# EAGLE design main_board2 (EAGLE 6.1)
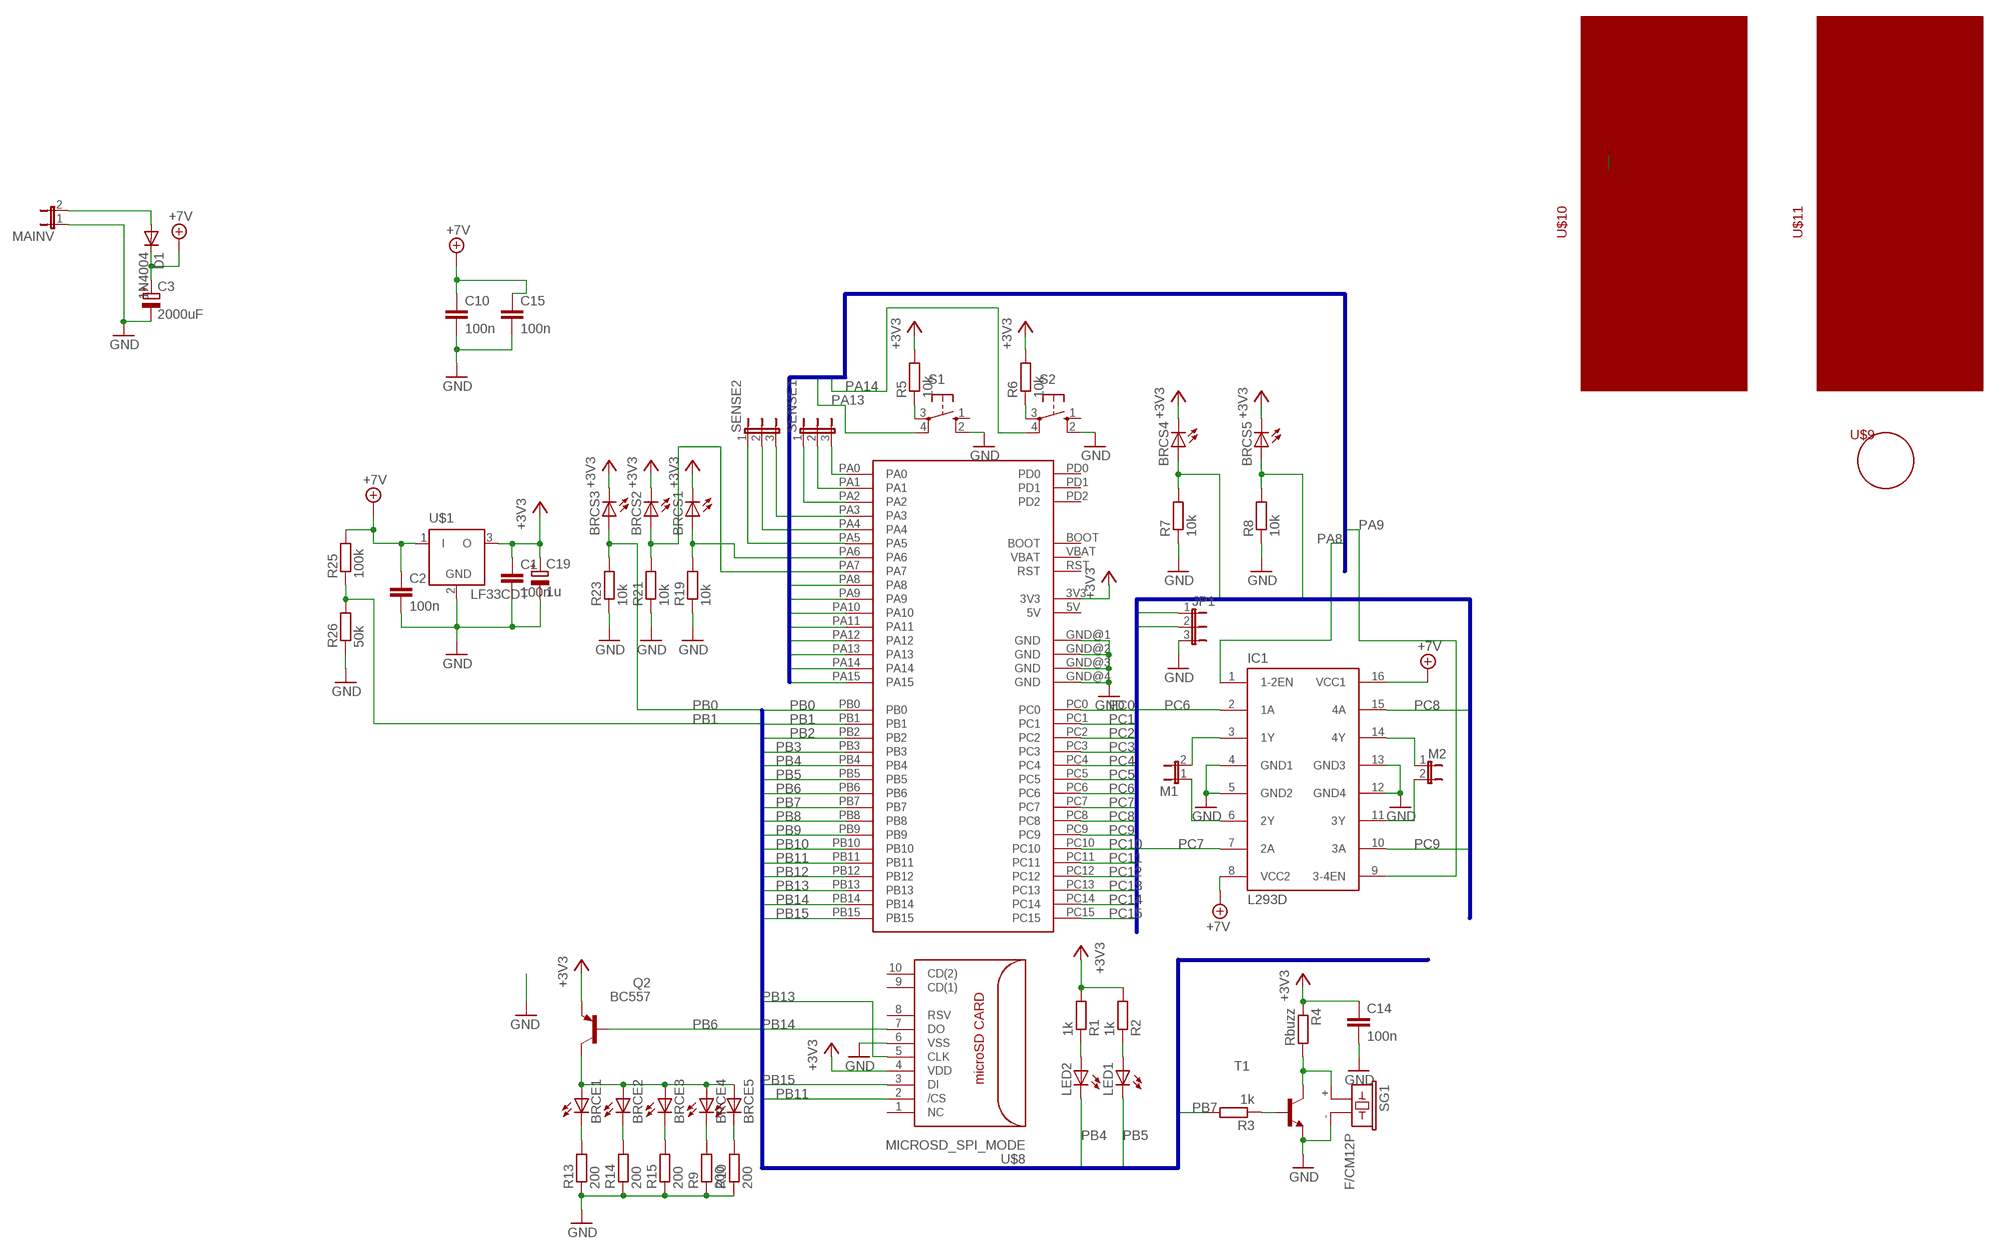
[diagram p0: schematic, sheet 1]

## Parts
BRCE1  LED5MM  [LED5MM]
BRCE2  LED5MM  [LED5MM]
BRCE3  LED5MM  [LED5MM]
BRCE4  LED5MM  [LED5MM]
BRCE5  LED5MM  [LED5MM]
BRCS1  LED5MM  [LED5MM]
BRCS2  LED5MM  [LED5MM]
BRCS3  LED5MM  [LED5MM]
BRCS4  LED5MM  [LED5MM]
BRCS5  LED5MM  [LED5MM]
C1  100n  C-EUC1206  [C1206]
C2  100n  C-EUC1206  [C1206]
C3  2000uF  CPOL-EUE3.5-10  [E3,5-10]
C10  100n  C-EUC1206  [C1206]
C14  100n  C-EUC1206  [C1206]
C15  100n  C-EUC1206  [C1206]
C19  1u  CPOL-EUB  [PANASONIC_B]
D1  1N4004  [DO41-10]
IC1  L293D  [DIL16]
JP1  JP2E  [JP2]
LED1  LED3MM  [LED3MM]
LED2  LED3MM  [LED3MM]
M1  JP1E  [JP1]
M2  JP1E  [JP1]
MAINV  JP1E  [JP1]
Q2  BC557  [TO92]
R1  1k  R-EU_M1206  [M1206]
R2  1k  R-EU_M1206  [M1206]
R3  1k  R-EU_M1206  [M1206]
R4  Rbuzz  R-EU_M1206  [M1206]
R5  10k  R-EU_M1206  [M1206]
R6  10k  R-EU_M1206  [M1206]
R7  10k  R-EU_M1206  [M1206]
R8  10k  R-EU_M1206  [M1206]
R9  200  R-EU_M1206  [M1206]
R10  200  R-EU_M1206  [M1206]
R13  200  R-EU_M1206  [M1206]
R14  200  R-EU_M1206  [M1206]
R15  200  R-EU_M1206  [M1206]
R19  10k  R-EU_M1206  [M1206]
R21  10k  R-EU_M1206  [M1206]
R23  10k  R-EU_M1206  [M1206]
R25  100k  R-EU_M1206  [M1206]
R26  50k  R-EU_M1206  [M1206]
S1  10-XX  [B3F-10XX]
S2  10-XX  [B3F-10XX]
SENSE1  JP2E  [JP2]
SENSE2  JP2E  [JP2]
SG1  F/CM12P  [F/CM12P]
T1  BC547B-NPN-TO92-CBE  [TO92-CBE]
U$1  LF33CDT  [DPAK]
U$2  STM32_DISCOVERY  [STM32_DISCOVERY]
U$8  MICROSD_SPI_MODE  [MICRO_SD_CONNECTOR]
U$9  POLOLU952  [BALLB]
U$10  POLOLU0993B  [MOTORB]
U$11  POLOLU0993B  [MOTORB]

## Nets
+3V3: BRCS1.K(C) BRCS2.K(C) BRCS3.K(C) BRCS4.K(C) BRCS5.K(C) C1.1 C14.1 C19.+ Q2.1(E) R1.2 R2.2 R4.1 R5.2 R6.2 U$1.3(O) U$2.3V3 U$8.4(VDD)
+7V: C2.1 C3.+ C10.1 C15.1 D1.C IC1.8(VCC2) IC1.16(VCC1) R25.2 U$1.1(I)
GND: C1.2 C2.2 C3.- C10.2 C14.2 C15.2 C19.- IC1.4(GND1) IC1.5(GND2) IC1.12(GND4) IC1.13(GND3) JP1.3 MAINV.1 R7.1 R8.1 R9.1 R10.1 R13.1 R14.1 R15.1 R19.1 R21.1 R23.1 R26.1 S1.2(S1) S2.2(S1) SG1.- T1.E U$1.2(GND) U$2.GND@1(GND) U$2.GND@2(GND) U$2.GND@3(GND) U$2.GND@4(GND) U$8.6(VSS)
N$1: SENSE1.3 U$2.PA0
N$2: SENSE1.2 U$2.PA1
N$3: SENSE1.1 U$2.PA2
N$4: SENSE2.3 U$2.PA3
N$5: SENSE2.2 U$2.PA4
N$6: SENSE2.1 U$2.PA5
N$7: LED2.A R1.1
N$8: LED1.A R2.1
N$9: R3.1 T1.B
N$10: R4.2 SG1.+ T1.C
N$11: R6.1 S2.3(P)
N$12: R5.1 S1.3(P)
N$13: BRCE4.K(C) R9.2
N$14: BRCE5.K(C) R10.2
N$28: BRCE1.K(C) R13.2
N$29: BRCE2.K(C) R14.2
N$30: BRCE3.K(C) R15.2
N$31: BRCE1.A BRCE2.A BRCE3.A BRCE4.A BRCE5.A Q2.3(C)
N$43: D1.A MAINV.2
N$44: BRCS1.A R19.2 U$2.PA6
N$46: BRCS2.A R21.2 U$2.PA7
N$53: IC1.3(1Y) M1.2
N$54: IC1.6(2Y) M1.1
N$55: IC1.14(4Y) M2.1
N$56: IC1.11(3Y) M2.2
PA8: IC1.1(1-2EN) U$2.PA8
PA9: IC1.9(3-4EN) U$2.PA9
PA10: U$2.PA10
PA11: U$2.PA11
PA12: U$2.PA12
PA13: S1.4(P1) U$2.PA13
PA14: S2.4(P1) U$2.PA14
PA15: U$2.PA15
PB0: BRCS3.A R23.2 U$2.PB0
PB1: R25.1 R26.2 U$2.PB1
PB2: U$2.PB2
PB3: U$2.PB3
PB4: LED2.K(C) U$2.PB4
PB5: LED1.K(C) U$2.PB5
PB6: Q2.2(B) U$2.PB6
PB7: R3.2 U$2.PB7
PB8: U$2.PB8
PB9: U$2.PB9
PB10: U$2.PB10
PB11: U$2.PB11 U$8.2(/CS)
PB12: U$2.PB12
PB13: U$2.PB13 U$8.5(CLK)
PB14: U$2.PB14 U$8.7(DO)
PB15: U$2.PB15 U$8.3(DI)
PC0: U$2.PC0
PC1: U$2.PC1
PC2: U$2.PC2
PC3: U$2.PC3
PC4: BRCS4.A R7.2 U$2.PC4
PC5: BRCS5.A R8.2 U$2.PC5
PC6: IC1.2(1A) U$2.PC6
PC7: IC1.7(2A) U$2.PC7
PC8: IC1.15(4A) U$2.PC8
PC9: IC1.10(3A) U$2.PC9
PC10: JP1.1 U$2.PC10
PC11: JP1.2 U$2.PC11
PC12: U$2.PC12
PC13: U$2.PC13
PC14: U$2.PC14
PC15: U$2.PC15
Unconnected: S1.1(S) S2.1(S) U$2.5V U$2.BOOT U$2.NC@1(NC) U$2.NC@2(NC) U$2.PD0 U$2.PD1 U$2.PD2 U$2.RST U$2.VBAT U$8.1(NC) U$8.8(RSV) U$8.9(CD(1)) U$8.10(CD(2))

## Buses
PC[0..15]
PB[0..15]
PA[8..15]

## Library data of the parts
BRCE1-BRCE5 BRCS1-BRCS5 LED1 LED2 = led:LED: LED OSRAM: - CHIPLED LG R971, LG N971, LY N971, LG Q971, LY Q971, LO R971, LY R971 LH N974, LH R974 LS Q976, LO Q976, LY Q976 LO Q996 - Hyper CHIPLED LW Q18S LB Q993, LB Q99A, LB R99A - SideLED LS A670, LO A670, LY A670, LG A670, LP A670 LB A673, LV A673, LT A673, LW A673 LH A674 LY A675 LS A676, LA A676, LO A676, LY A676, LW A676 LS A679, LY A679, LG A679 - Hyper Micro SIDELED® LS Y876, LA Y876, LO Y876, LY Y876 LT Y87S - SmartLED LW L88C, LW L88S LB L89C, LB L89S, LG L890 LS L89K, LO L89K, LY L89K LS L896, LA L896, LO L896, LY L896 - TOPLED LS T670, LO T670, LY T670, LG T670, LP T670 LSG T670, LSP T670, LSY T670, LOP T670, LYG T670 LG T671, LOG T671, LSG T671 LB T673, LV T673, LT T673, LW T673 LH T674 LS T676, LA T676, LO T676, LY T676, LB T676, LH T676, LSB T676, LW T676 LB T67C, LV T67C, LT T67C, LS T67K, LO T67K, LY T67K, LW E67C LS E67B, LA E67B, LO E67B, LY E67B, LB E67C, LV E67C, LT E67C LW T67C LS T679, LY T679, LG T679 LS T770, LO T770, LY T770, LG T770, LP T770 LB T773, LV T773, LT T773, LW T773 LH T774 LS E675, LA E675, LY E675, LS T675 LS T776, LA T776, LO T776, LY T776, LB T776 LHGB T686 LT T68C, LB T68C - Hyper Mini TOPLED® LB M676 - Mini TOPLED Santana® LG M470 LS M47K, LO M47K, LY M47K Source: http://www.osram.convergy.de LUXEON: - LUMILED® LXK2-PW12-R00, LXK2-PW12-S00, LXK2-PW14-U00, LXK2-PW14-V00 LXK2-PM12-R00, LXK2-PM12-S00, LXK2-PM14-U00 LXK2-PE12-Q00, LXK2-PE12-R00, LXK2-PE12-S00, LXK2-PE14-T00, LXK2-PE14-U00 LXK2-PB12-K00, LXK2-PB12-L00, LXK2-PB12-M00, LXK2-PB14-N00, LXK2-PB14-P00, LXK2-PB14-Q00 LXK2-PR12-L00, LXK2-PR12-M00, LXK2-PR14-Q00, LXK2-PR14-R00 LXK2-PD12-Q00, LXK2-PD12-R00, LXK2-PD12-S00 LXK2-PH12-R00, LXK2-PH12-S00 LXK2-PL12-P00, LXK2-PL12-Q00, LXK2-PL12-R00 Source: www.luxeon.com KINGBRIGHT: KA-3528ASYC Source: www.kingbright.com
C1 C2 C10 C14 C15 = rcl:C-EU: CAPACITOR, European symbol
C3 C19 = rcl:CPOL-EU: POLARIZED CAPACITOR, European symbol
D1 = diode:1N4004: DIODE general purpose rectifier, 1 A
IC1 = st-microelectronics:L293D: PUSH-PULL 4 CHANNEL DRIVER; MPN: L293D; OC_FARNELL: 9589619; OC_NEWARK: 56P8249
JP1 SENSE1 SENSE2 = jumper:JP2E: JUMPER
M1 M2 MAINV = jumper:JP1E: JUMPER
Q2 = transistor-pnp:BC557: PNP Transistor
R1-R10 R13-R15 R19 R21 R23 R25 R26 = resistor:R-EU_: RESISTOR, European symbol
S1 S2 = switch-omron:10-XX: OMRON SWITCH; MPN: B3F-1000; OC_FARNELL: 176432; OC_NEWARK: 36M3542
SG1 = buzzer:F/CM12P: BUZZER Source: Buerklin; OC_FARNELL: unknown; OC_NEWARK: unknown
T1 = transistor:*-NPN-: NPN Transistror BF959 corrected 2008.03.06
U$1 = robot:LF33CDT
U$2 = stm32_discovery:STM32_DISCOVERY: STM32 Value line discovery
U$8 = con-molex-microsd:MICROSD_SPI_MODE: MOLEX - 49225-0821 - CONNECTEUR MICRO SD PUSH/PUSH REV Fabricant: MOLEX Code commande Farnell: 1366700 <http://fr.farnell.com/molex/49225-0821/connecteur-micro-sd-push-push-rev/dp/1366700?Ntt=1366700> Référence fabricant: 49225-0821
U$9 = robot:POLOLU952
U$10 U$11 = robot:POLOLU0993B

## Board
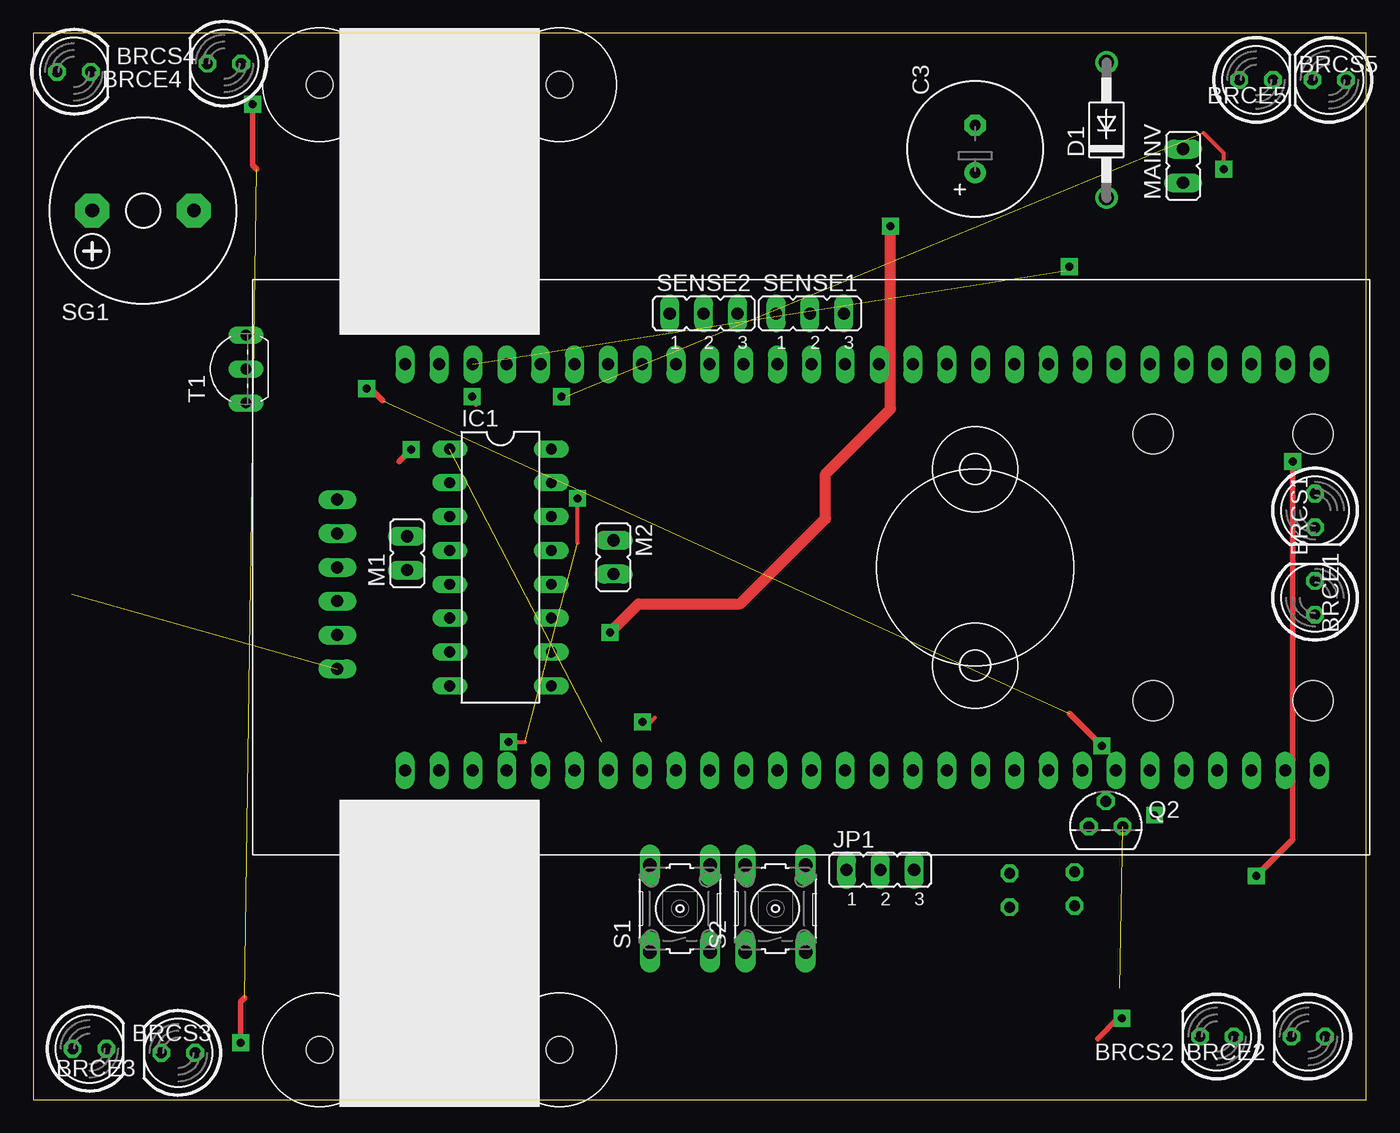
[diagram p1: board, top side]
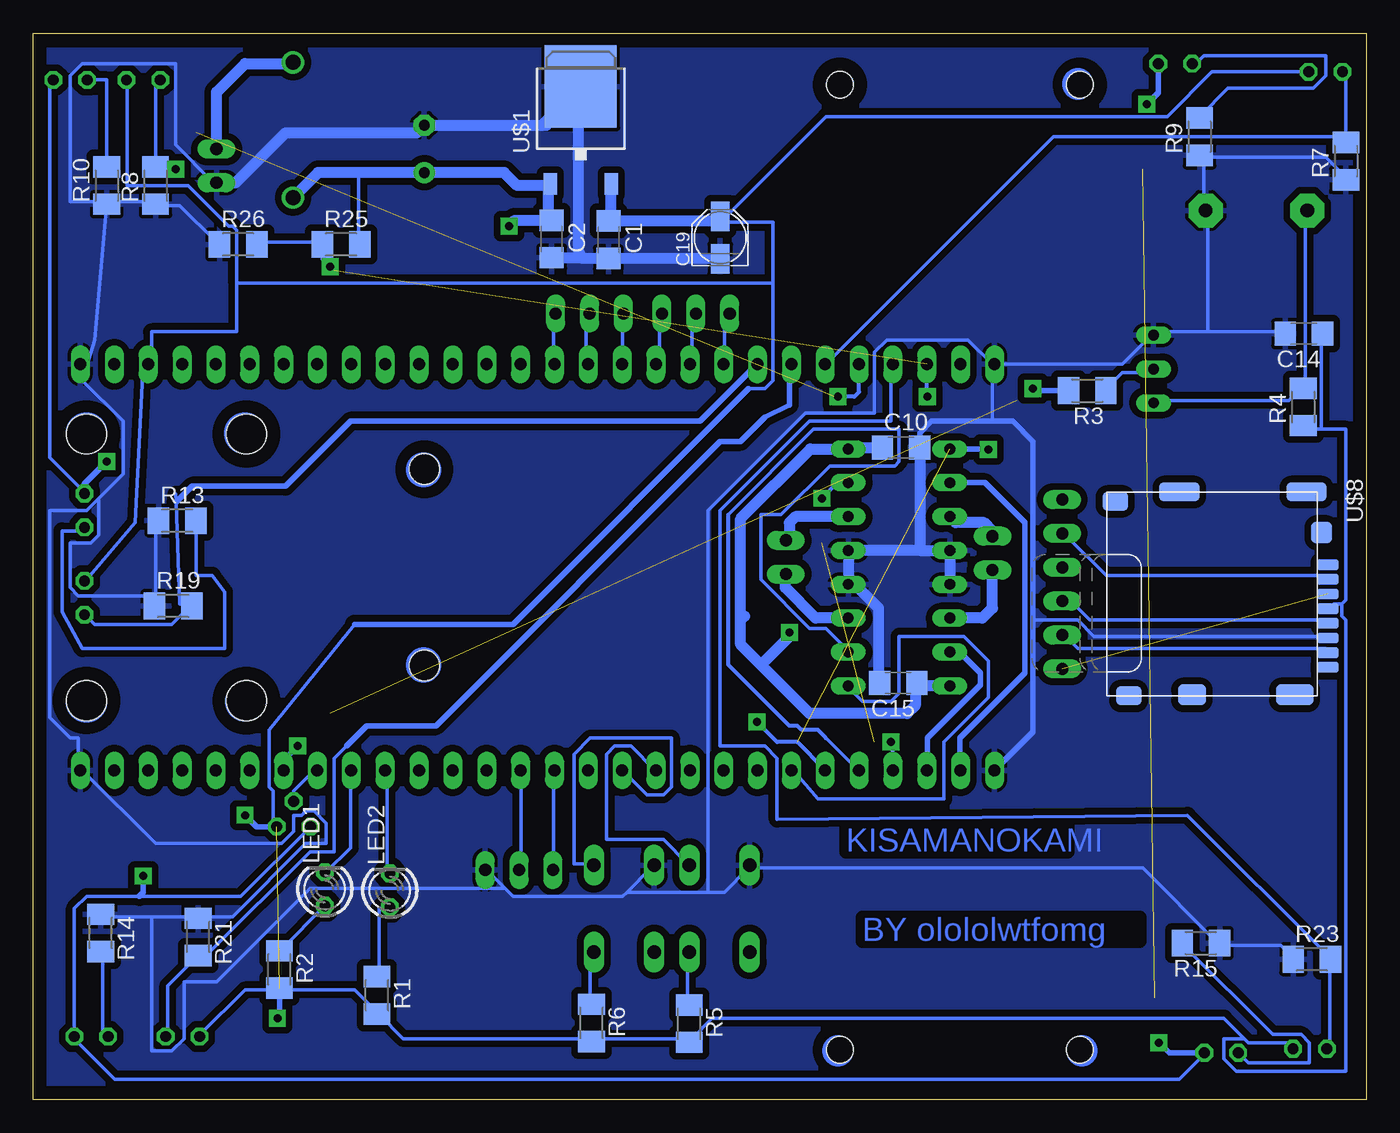
[diagram p2: board, bottom side, seen from below]

Size 100 x 80 mm. Coordinates in mm from the lower left corner, seen from the top.
Outline: 0,0 100,0 100,80 0,80 0,0
Copper layers (1*16): Top 0.035mm / dielectric 1.5mm / Bottom 0.035mm
Design rules "default": minimum track width 10mil, minimum drill 24mil, track to track 8mil, track to pad 8mil, pad to pad 8mil, via to via 8mil, smd to smd 8mil, copper to edge 40mil, drill to drill 8mil, minimum pad ring 10mil, minimum via ring 8mil, stop-mask expansion 4mil, vias tented up to drill 0mil, thermal gap 10mil
Holes 3 mm at 96.01,49.93 96.01,29.93 84.01,49.93 84.01,29.92

### Footprints (pad centres in the part's own frame; a part is rotated, then mirrored left to right if it is on the bottom)
LED5MM = drill 0.813 octagon: A -1.27,0; K 1.27,0
C1206 = smd 1.6 x 1.8: 1 -1.4,0; 2 1.4,0
E3,5-10 = drill 0.813 pad 1.6 round: + -1.778,0 | drill 0.813 pad 1.6 octagon: - 1.778,0
PANASONIC_B = smd 2.2 x 1.4: + 1.6,0; - -1.6,0
DO41-10 = drill 1.118 round: A 5.08,0; C -5.08,0
DIL16 = drill 0.813 long: 1 -8.89,-3.81; 2 -6.35,-3.81; 3 -3.81,-3.81; 4 -1.27,-3.81; 5 1.27,-3.81; 6 3.81,-3.81; 7 6.35,-3.81; 8 8.89,-3.81; 9 8.89,3.81; 10 6.35,3.81; 11 3.81,3.81; 12 1.27,3.81; 13 -1.27,3.81; 14 -3.81,3.81; 15 -6.35,3.81; 16 -8.89,3.81
JP2 = drill 0.914 long: 1 -2.54,0; 2 0,0; 3 2.54,0
LED3MM = drill 0.813 octagon: A -1.27,0; K 1.27,0
JP1 = drill 0.914 long: 1 0,-1.27; 2 0,1.27
TO92 = drill 0.813 octagon: 1 1.27,0; 2 0,1.905; 3 -1.27,0
M1206 = smd 1.6 x 2: 1 -1.4,0; 2 1.4,0
B3F-10XX = drill 1.016 long: 1 -3.251,2.261; 2 3.251,2.261; 3 -3.251,-2.261; 4 3.251,-2.261
F/CM12P = drill 1.016 pad 2.54 octagon: + 3.81,0; - -3.81,0
TO92-CBE = drill 0.813 long: B 0,0; C -2.54,0; E 2.54,0
DPAK = smd 1 x 1.6: 1 -2.28,-6.07; 3 2.28,-6.07 | smd 5.4 x 6.2: 2 0,1.23
STM32_DISCOVERY = drill 0.9 long: 3V3 -15.24,29.21; 5V 15.24,29.21; BOOT 15.24,21.59; GND@1 -15.24,34.29; GND@2 15.24,34.29; GND@3 -15.24,-34.29; GND@4 15.24,-34.29; NC@1 -15.24,31.75; NC@2 15.24,31.75; PA0 -15.24,-1.27; PA1 -15.24,-3.81; PA2 -15.24,-6.35; PA3 -15.24,-8.89; PA4 -15.24,-11.43; PA5 -15.24,-13.97; PA6 -15.24,-16.51; PA7 -15.24,-19.05; PA8 15.24,-21.59; PA9 15.24,-19.05; PA10 15.24,-16.51; PA11 15.24,-13.97; PA12 15.24,-11.43; PA13 15.24,-8.89; PA14 15.24,-6.35; PA15 15.24,-3.81; PB0 -15.24,-26.67; PB1 -15.24,-29.21; PB2 -15.24,-31.75; PB3 15.24,8.89; PB4 15.24,11.43; PB5 15.24,13.97; PB6 15.24,16.51; PB7 15.24,19.05; PB8 15.24,24.13; PB9 15.24,26.67; PB10 -5.08,-39.37; PB11 -2.54,-39.37; PB12 0,-39.37; PB13 2.54,-39.37; PB14 5.08,-39.37; PB15 7.62,-39.37; PC0 -15.24,8.89; PC1 -15.24,6.35; PC2 -15.24,3.81; PC3 -15.24,1.27; PC4 -15.24,-21.59; PC5 -15.24,-24.13; PC6 15.24,-31.75; PC7 15.24,-29.21; PC8 15.24,-26.67; PC9 15.24,-24.13; PC10 15.24,-1.27; PC11 15.24,1.27; PC12 15.24,3.81; PC13 -15.24,24.13; PC14 -15.24,21.59; PC15 -15.24,19.05; PD0 -15.24,16.51; PD1 -15.24,13.97; PD2 15.24,6.35; RST -15.24,11.43; VBAT -15.24,26.67
MICRO_SD_CONNECTOR = smd 0.8 x 1.6: 1 -2.03,8.2; 2 -0.93,8.2; 3 0.17,8.2; 4 1.27,8.2; 5 2.37,8.2; 6 3.47,8.2; 7 4.57,8.2; 8 5.67,8.2 | smd 1.55 x 2.8: 9 7.735,5.7 | smd 1.55 x 2.1: 10 7.735,-2 | smd 1.4 x 1.9: 11 7.81,-6.75; 12 -6.79,-7.75 | smd 1.4 x 3: 13 -7.49,-2.95; 14 -7.49,6.6 | smd 1.6 x 1.55: 15 -4.43,7.725
BALLB = hole 2.286: -7.366,0; 7.366,0
MOTORB = hole 2: -9,7.25; 9,7.25

### Placement (x,y rotation side)
BRCE1  96.16,44.2 270 top
BRCE2  95.66,4.72 180 top
BRCE3  10.87,3.51 180 top
BRCE4  14.33,77.72 180 top
BRCE5  97.23,76.5 180 top
BRCS1  96.16,37.64 90 top
BRCS2  88.8,4.72 180 top
BRCS3  4.22,3.81 0 top
BRCS4  3.05,77.11 0 top
BRCS5  91.74,76.5 0 top
C1  56.85,64.52 270 bottom
C2  61.11,64.57 270 bottom
C3  70.66,71.32 90 top
C10  34.9,48.92 0 bottom
C14  4.67,57.45 180 bottom
C15  35.1,31.24 180 bottom
C19  48.46,64.67 90 bottom
D1  80.52,72.75 90 top
IC1  35.05,39.93 270 top
JP1  63.55,17.22 0 top
LED1  78.13,15.8 90 bottom
LED2  73.25,15.7 90 bottom
M1  28.04,41 0 top
M2  43.54,40.69 180 top
MAINV  86.26,70.05 0 top
Q2  80.47,20.47 0 top
R1  74.22,7.82 270 bottom
R2  81.53,9.75 270 bottom
R3  20.93,53.19 180 bottom
R4  4.72,51.97 90 bottom
R5  50.8,5.69 270 bottom
R6  58.12,5.74 270 bottom
R7  1.52,70.41 90 bottom
R8  90.83,68.58 90 bottom
R9  12.5,72.24 90 bottom
R10  94.49,68.58 90 bottom
R13  89.2,43.43 0 bottom
R14  94.95,12.5 270 bottom
R15  12.4,11.73 180 bottom
R19  89.51,37.03 0 bottom
R21  87.63,12.19 270 bottom
R23  4.06,10.52 0 bottom
R25  76.91,64.16 0 bottom
R26  84.63,64.16 0 bottom
S1  48.51,14.33 90 top
S2  55.68,14.33 90 top
SENSE1  58.27,58.98 0 top
SENSE2  50.29,58.98 0 top
SG1  8.23,66.7 180 top
T1  15.95,54.81 90 top
U$1  58.93,74.78 0 bottom
U$2  62.18,39.93 270 top
U$8  11.07,38.1 270 bottom
U$9  70.66,39.93 90 top
U$10  30.48,68.88 0 top
U$11  30.48,10.97 180 top

### Tracks (layer width: path | path; a pad name or v marks a point on that pad's centre or on a via)
+3V3  (via drill 0.6 pad 1.27)  (1 unrouted)
  Top 0.406: v81.69,6.1 81.38,6.1 79.86,4.57 | v84.12,21.34 84.43,21.03
  Bottom 0.254: BRCS1.K 96.01,39.01 92.35,43.28 91.75,55.17 U$2.3V3 91.14,55.17 91.14,57.61 84.73,57.61 84.73,61.27 | 84.73,61.27 84.73,65.23 85.04,65.53 85.34,65.53 88.39,68.58 92.96,68.58 92.96,76.5 BRCS5.K | C1.1 56.69,65.53 | BRCS4.K 11.58,77.11 14.94,73.76 40.54,73.76 48.16,66.14 C19.+ 48.16,65.84 44.5,65.84 44.5,61.27 | 75.89,35.66 82.3,27.74 82.3,23.47 81.99,23.16 81.99,20.73 Q2.1 | 46.33,53.34 45.11,53.34 44.5,53.95 44.5,61.27 | 44.5,61.27 84.73,61.27 | 1.83,37.19 2.44,37.19 2.74,36.88 U$8.4 | 1.83,37.19 1.52,37.49 1.52,50.29 3.35,50.29 | 3.35,50.29 4.57,50.29 R4.1 | 3.35,50.29 3.35,57.3 C14.1 | BRCS2.K 87.48,4.88 84.12,8.23 81.69,8.23 R2.2 81.38,8.23 75.89,8.23 74.37,6.71 R1.2 74.07,6.4 72.24,4.57 58.22,4.57 R6.2 57.91,4.57 50.9,4.57 R5.2 50.6,4.57 49.07,6.1 10.67,6.1 9.14,4.57 | 9.14,4.57 8.84,4.27 5.79,4.27 5.49,3.96 BRCS3.K | 1.83,37.19 1.83,36.27 1.52,35.97 1.52,2.13 9.75,2.13 10.67,3.05 10.67,4.57 9.14,4.57
  Bottom 0.406: R2.2 81.53,6.25 v81.69,6.1 | Q2.1 83.26,20.47 v84.12,21.34 | 75.89,35.66 64.01,35.66 46.33,53.34
  Bottom 0.813: U$1.3 56.65,65.58 56.69,65.53 | C1.1 48.51,65.92 C19.+
+7V  (via drill 0.6 pad 1.27)
  Top 0.813: v64.31,65.53 64.31,51.82 59.44,46.94 59.44,43.59 53.03,37.19 45.41,37.19 v43.28,35.05
  Bottom 0.254: R25.2 75.59,64.31 75.59,69.55
  Bottom 0.813: D1.C 78.64,69.55 75.59,69.55 C3.+ 64.67,69.55 63.7,68.58 61.34,68.58 | 61.34,68.58 U$1.1 | C10.1 38.76,48.92 IC1.16 41.71,48.82 46.94,43.59 46.94,35.97 | 46.94,35.97 46.94,34.14 45.41,32.61 | 45.41,32.61 41.76,28.96 34.44,28.96 33.83,29.57 33.83,31.11 C15.1 33.5,31.04 IC1.8 | 61.34,68.58 61.34,66.19 C2.1 63.88,65.97 v64.31,65.53 | 46.94,35.97 46.63,36.27 | v43.28,35.05 43.28,34.75 45.41,32.61
GND
  Bottom 0.254: 59.13,74.98 59.44,74.98 U$1.2 | R26.1 86.26,64.31 89,67.06 90.83,67.06 R8.1 90.83,67.36 94.49,67.36 | R13.1 90.83,43.28 90.83,37.19 R19.1 91.14,37.19 91.75,37.8 96.62,37.8 97.23,38.41 97.23,41.76 95.71,41.76 95.1,42.37 95.1,45.11 | 95.1,45.11 93.27,46.94 93.27,50.9 96.32,53.95 | 95.1,45.11 96.01,44.2 98.75,44.2 98.75,28.65 97.23,27.13 96.62,27.13 96.62,24.69 U$2.GND@2 96.32,24.69 90.83,19.2 81.38,19.2 80.47,20.12 80.47,21.34 79.86,21.34 79.55,21.64 78.94,21.64 78.03,20.73 78.03,19.2 79.55,19.2 85.04,13.72 87.48,13.72 R21.1 87.78,13.72 91.14,13.72 | 96.32,53.95 95.4,57 R10.1 94.49,67.36 | 96.32,53.95 U$2.GND@1 | 94.49,67.36 97.23,67.36 97.23,76.81 96.32,77.72 89.31,77.72 89.31,71.63 86.56,68.89 MAINV.1 | 11.89,57.61 15.85,57.61 T1.E 16.15,57.3 18.29,55.17 U$2.GND@3 28.04,55.17 | 11.89,57.61 6.1,57.61 C14.2 | 12.19,70.71 12.5,70.71 R9.1 12.19,70.71 | 12.19,70.71 3.05,70.71 1.52,69.19 R7.1 | 12.19,70.71 12.19,66.75 SG1.- 11.89,66.45 11.89,57.61 | 24.99,35.97 21.64,35.97 20.42,34.75 3.05,34.75 U$8.6 | 28.04,55.17 28.04,50.9 | 91.14,13.72 94.79,13.72 R14.1 | R23.1 5.49,10.67 6.4,11.58 10.97,11.58 R15.1 11.28,11.89 16.76,17.37 46.02,17.37 S1.2 46.33,17.37 48.16,15.54 49.38,15.54 | 64.62,15.85 64.01,15.24 55.78,15.24 55.47,15.54 | 64.62,15.85 65.84,17.07 JP1.3 | 55.47,15.54 53.65,17.37 S2.2 | 49.38,15.54 55.47,15.54 | 91.14,13.72 91.14,3.66 89.61,3.66 88.7,4.57 88.7,8.84 86.26,8.84 79.25,15.85 64.62,15.85 | 28.04,55.17 29.87,57 35.97,57 36.88,56.08 36.88,51.51 42.06,51.51 49.38,44.2 49.38,15.54
  Bottom 0.406: C10.2 33.5,50.02 32.61,50.9 28.04,50.9 26.52,50.9 24.99,49.38 24.99,35.97 24.99,27.58 U$2.GND@4
  Bottom 0.813: MAINV.1 84.84,68.78 81.08,72.54 71.22,72.54 C3.- 61.83,73.1 | 61.83,73.1 U$1.2 | 33.53,41.2 IC1.4 IC1.5 | 33.53,41.2 IC1.13 IC1.12 38.35,38.66 36.58,36.88 36.58,31.32 C15.2 | C10.2 33.5,41.23 33.53,41.2 | C19.- 48.82,63.12 C1.2 58.83,63.12 | 58.83,63.12 61.06,63.12 C2.2 | 61.83,73.1 61.52,73.1 | 58.83,63.12 59.13,63.73 59.13,74.98
  pour Bottom (isolate 0.508): 0.3,78.94 99.67,78.94 99.67,1.22 0.3,1.22
N$1
  Bottom 0.254: U$2.PA0 60.96,55.17 60.96,58.83 SENSE1.3
N$2
  Bottom 0.254: U$2.PA1 58.52,55.17 58.52,58.83 SENSE1.2
N$3
  Bottom 0.254: U$2.PA2 55.78,55.17 55.78,58.83 SENSE1.1
N$4
  Bottom 0.254: U$2.PA3 53.03,55.17 53.03,58.83 SENSE2.3
N$5
  Bottom 0.254: U$2.PA4 50.6,55.17 50.6,58.83 50.29,58.83 SENSE2.2
N$6
  Bottom 0.254: U$2.PA5 48.16,55.17 48.16,58.83 47.85,58.83 SENSE2.1
N$7
  Bottom 0.254: R1.1 74.07,9.45 74.07,14.33 73.46,14.33 LED2.A
N$8
  Bottom 0.254: R2.1 81.38,11.28 LED1.A
N$9
  Bottom 0.254: R3.1 19.51,53.34 18.29,54.56 16.15,54.56 T1.B
N$10
  Bottom 0.254: T1.C 15.85,52.43 5.79,52.43 4.88,53.34 R4.2 4.57,53.65 4.57,66.45 SG1.+
N$11
  Bottom 0.254: R6.1 58.22,7.32 58.22,10.97 S2.3
N$12
  Bottom 0.254: R5.1 50.9,7.32 50.9,10.97 S1.3
N$13
  Bottom 0.254: R9.2 12.5,73.76 10.36,75.89 3.96,75.89 3.05,76.81 3.05,78.33 12.19,78.33 12.8,77.72 BRCE4.K
N$14
  Bottom 0.254: R10.2 94.49,76.5 BRCE5.K
N$28
  Bottom 0.254: R13.2 87.78,43.28 87.78,39.32 86.56,39.32 85.65,38.1 85.65,33.83 96.32,33.83 97.84,36.58 97.84,42.67 96.32,42.67 BRCE1.K
N$29
  Bottom 0.254: R14.2 94.79,10.97 94.79,4.88 94.49,4.88 BRCE2.K
N$30
  Bottom 0.254: R15.2 13.72,11.58 7.01,4.88 4.88,4.88 4.27,4.27 4.27,2.74 8.84,2.74 BRCE3.K
N$31  (via drill 0.6 pad 1.27)  (1 unrouted)
  Top 0.406: v16.46,74.68 16.46,70.1 16.76,69.8 | v15.54,4.27 15.54,7.32 15.85,7.62 | v94.49,47.85 94.49,19.51 v91.75,16.76
  Bottom 0.254: BRCE3.A 12.19,3.35 14.02,1.52 93.88,1.52 96.93,4.57 BRCE2.A 96.93,14.33 96.01,15.24 92.05,15.24 84.43,15.24 Q2.3 | BRCE1.A 96.32,45.72 98.75,48.16 98.75,76.5 BRCE5.A
  Bottom 0.406: BRCE4.A 15.6,75.54 v16.46,74.68 | BRCE3.A 14.78,3.5 v15.54,4.27 | BRCE1.A 96.16,46.18 v94.49,47.85 | v91.75,16.76 91.75,15.54 92.05,15.24
N$43
  Bottom 0.813: MAINV.2 86.26,75.59 84.12,77.72 80.62,77.72 D1.A
N$44
  Bottom 0.254: BRCS1.A 96.01,36.27 95.4,35.66 89.61,35.66 88.39,36.88 R19.2 88.39,37.19 89,37.19 89.28,44.82 89.31,45.41 | U$2.PA6 45.72,55.17
  Bottom 0.406: 45.72,55.17 49.99,50.9 76.2,50.9 81.08,46.02 88.08,46.02 89.28,44.82
N$46
  Bottom 0.254: BRCS2.A 89.92,4.88 89.92,8.53 87.78,10.67 R21.2 87.48,10.97 86.87,10.97 79.25,18.59 77.42,18.59 77.42,25.6 76.5,26.52 | 43.28,55.17 U$2.PA7
  Bottom 0.406: 43.28,55.17 43.28,52.12 45.11,51.21 46.94,49.38 48.46,49.38 69.8,28.04 74.98,28.04 76.5,26.52
N$53
  Bottom 0.813: M1.2 28.04,42.67 28.65,43.28 30.79,43.28 IC1.3
N$54
  Bottom 0.813: IC1.6 28.8,36.12 28.04,36.88 M1.1
N$55
  Bottom 0.813: IC1.14 42.82,43.74 43.28,43.28 43.28,42.22 M2.1
N$56
  Bottom 0.813: IC1.11 41.3,36.12 43.59,38.41 43.59,39.37 M2.2
PA8  (via drill 0.6 pad 1.27)  (1 unrouted)
  Top 0.305: v45.72,28.35 46.33,28.35 46.63,28.65
  Top 0.406: 27.43,47.85 v28.35,48.77
  Bottom 0.305: U$2.PA8 40.59,24.74 42.67,26.82 44.2,26.82 v45.72,28.35
  Bottom 0.406: 28.04,48.77 28.09,48.82 IC1.1 28.4,48.82 v28.35,48.77
PA9
  Bottom 0.254: IC1.9 38.71,30.79 37.8,29.87 35.66,29.87 35.05,30.48 35.05,34.75 30.18,34.75 28.35,32.92 28.35,30.18 31.7,26.82 31.7,22.55 41.15,22.55 42.98,24.69 U$2.PA9
PA13
  Bottom 0.254: U$2.PA13 53.34,24.69 55.17,26.52 56.39,26.52 57,25.91 57,19.51 52.73,19.51 50.9,17.68 S1.4
PA14
  Bottom 0.254: U$2.PA14 55.78,24.69 53.95,22.86 52.73,22.86 52.12,23.47 52.12,27.13 58.22,27.13 59.44,25.91 59.44,17.68 58.22,17.68 S2.4
PB0
  Bottom 0.254: BRCS3.A 2.74,3.96 2.74,10.36 R23.2 2.74,10.67 13.41,21.34 44.2,21.03 44.2,25.6 45.11,26.52 48.46,26.52 48.46,44.2 41.76,50.9 35.66,50.9 35.66,55.17 U$2.PB0
PB1  (via drill 0.6 pad 1.27)  (1 unrouted)
  Top 0.305: v32.92,52.73 32.92,52.43 33.22,52.12 | v77.72,62.48 77.42,62.18
  Bottom 0.254: R25.1 78.33,64.31 83.21,64.31 R26.2
  Bottom 0.305: U$2.PB1 32.97,52.78 v32.92,52.73 | R25.1 78.31,63.07 v77.72,62.48
PB4
  Bottom 0.254: LED2.K 73.46,17.07 73.46,24.69 U$2.PB4
PB5
  Bottom 0.254: LED1.K 78.03,17.07 76.2,18.9 76.2,24.69 U$2.PB5
PB6
  Bottom 0.254: Q2.2 80.47,23.16 78.94,24.69 U$2.PB6
PB7  (via drill 0.6 pad 1.27)  (1 unrouted)
  Top 0.406: v24.99,53.34 25.3,53.34 26.21,52.43 | v80.16,26.52 77.72,28.96
  Bottom 0.406: R3.2 24.84,53.19 v24.99,53.34 | U$2.PB7 81.23,25.45 v80.16,26.52
PB11
  Bottom 0.254: U$8.2 3.05,39.32 19.51,39.32 22.55,42.37 U$2.PB11
PB13
  Bottom 0.254: U$8.5 3.05,35.97 20.73,35.97 21.95,37.19 22.55,37.19 U$2.PB13
PB14
  Bottom 0.254: U$8.7 3.05,33.83 21.64,33.83 22.55,34.75 U$2.PB14
PB15  (1 unrouted)
PC4
  Bottom 0.254: 1.52,72.24 1.52,77.11 BRCS4.A | 1.52,72.24 R7.2 1.52,71.93 | 1.52,72.24 23.47,72.24 40.54,55.17 U$2.PC4
PC5  (via drill 0.6 pad 1.27)  (1 unrouted)
  Top 0.305: v39.62,52.73 39.93,52.73 | v89.31,69.8 89.31,71.02 87.78,72.54
  Bottom 0.254: R8.2 90.83,76.5 BRCS5.A
  Bottom 0.305: U$2.PC5 38.05,53.09 38.41,52.73 v39.62,52.73 | R8.2 89.49,69.98 v89.31,69.8
PC6
  Bottom 0.406: IC1.2 28.6,46.28 25.6,43.28 25.6,32 30.48,27.13 30.48,24.74 U$2.PC6
PC7
  Bottom 0.406: IC1.7 30.53,33.58 28.96,32 28.96,31.09 32.92,27.13 32.92,24.74 U$2.PC7
PC8  (via drill 0.6 pad 1.27)  (1 unrouted)
  Top 0.305: 40.84,41.76 v40.84,45.11 | v35.66,26.82 36.88,26.82
  Bottom 0.305: IC1.15 39.67,46.28 v40.84,45.11 | U$2.PC8 35.51,26.67 v35.66,26.82
PC9
  Bottom 0.254: 47.85,43.89 41.45,50.29 35.05,50.29 35.05,47.85 35.36,47.55 40.23,47.55 43.89,43.89 45.41,43.89 45.41,39.01 41.76,35.36 40.54,35.36 39.01,33.83 IC1.10 | 40.54,27.13 38.1,24.69 U$2.PC9
  Bottom 0.305: 47.85,43.89 47.85,32.61 43.28,28.04 42.67,28.04 42.37,27.74 41.15,27.74 40.54,27.13
PC10
  Bottom 0.254: U$2.PC10 60.96,24.69 60.96,17.37 JP1.1
PC11
  Bottom 0.254: U$2.PC11 63.4,24.69 63.4,17.37 JP1.2
(copper drawn outside any net)
  shapes: Bottom circle x10

### Text on the board
Bottom: KISAMANOKAMI | BY olololwtfomg